# EAGLE design R2P_GW_module (EAGLE 6.3)
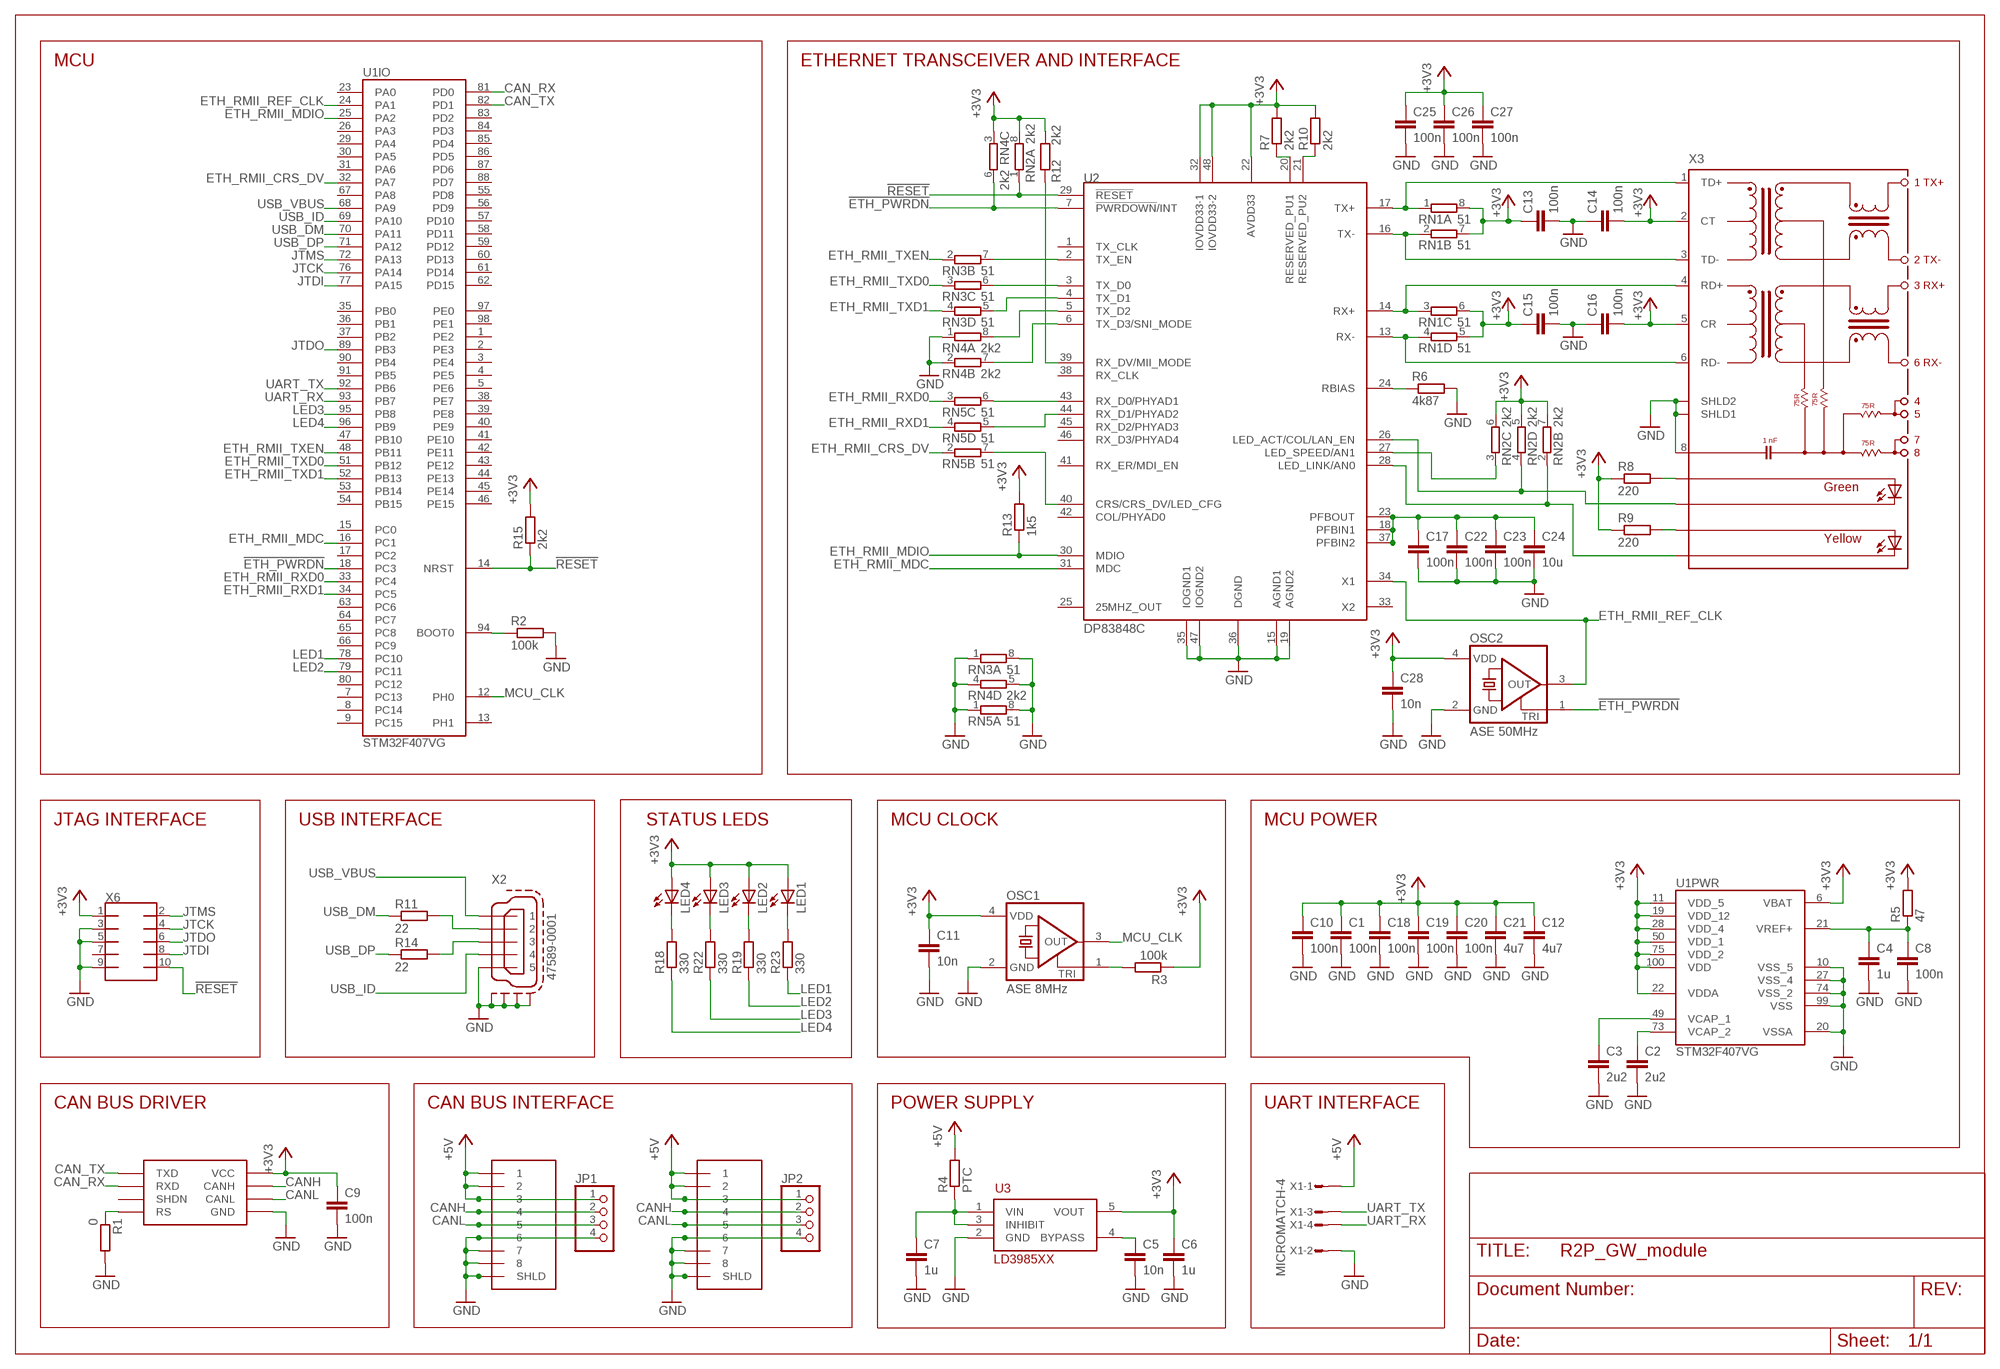
[diagram p0: schematic, sheet 1]

## Parts
C1  100n  C-EUC0603  [C0603]
C2  2u2  C-EUC0805  [C0805]
C3  2u2  C-EUC0805  [C0805]
C4  1u  C-EUC0603  [C0603]
C5  10n  C-EUC0603  [C0603]
C6  1u  C-EUC0603  [C0603]
C7  1u  C-EUC0603  [C0603]
C8  100n  C-EUC0603  [C0603]
C9  100n  C-EUC0603  [C0603]
C10  100n  C-EUC0603  [C0603]
C11  10n  C-EUC0603  [C0603]
C12  4u7  C-EUC0805  [C0805]
C13  100n  C-EUC0603  [C0603]
C14  100n  C-EUC0603  [C0603]
C15  100n  C-EUC0603  [C0603]
C16  100n  C-EUC0603  [C0603]
C17  100n  C-EUC0603  [C0603]
C18  100n  C-EUC0603  [C0603]
C19  100n  C-EUC0603  [C0603]
C20  100n  C-EUC0603  [C0603]
C21  4u7  C-EUC0805  [C0805]
C22  100n  C-EUC0603  [C0603]
C23  100n  C-EUC0603  [C0603]
C24  10u  C-EUC0805  [C0805]
C25  100n  C-EUC0603  [C0603]
C26  100n  C-EUC0603  [C0603]
C27  100n  C-EUC0603  [C0603]
C28  10n  C-EUC0603  [C0603]
JP1  PINHD-1X4  [1X04]
JP2  PINHD-1X4  [1X04]
LED1  LEDCHIPLED_0805  [CHIPLED_0805]
LED2  LEDCHIPLED_0805  [CHIPLED_0805]
LED3  LEDCHIPLED_0805  [CHIPLED_0805]
LED4  LEDCHIPLED_0805  [CHIPLED_0805]
OSC1  ASE 8MHz  ASE  [ASE]
OSC2  ASE 50MHz  ASE  [ASE]
R1  0  R-EU_R0603  [R0603]
R2  100k  R-EU_R0603  [R0603]
R3  100k  R-EU_R0603  [R0603]
R4  PTC  R-EU_R0603  [R0603]
R5  47  R-EU_R0603  [R0603]
R6  4k87  R-EU_R0603  [R0603]
R7  2k2  R-EU_R0603  [R0603]
R8  220  R-EU_R0603  [R0603]
R9  220  R-EU_R0603  [R0603]
R10  2k2  R-EU_R0603  [R0603]
R11  22  R-EU_R0603  [R0603]
R12  2k2  R-EU_R0603  [R0603]
R13  1k5  R-EU_R0603  [R0603]
R14  22  R-EU_R0603  [R0603]
R15  2k2  R-EU_R0603  [R0603]
R18  330  R-EU_R0603  [R0603]
R19  330  R-EU_R0603  [R0603]
R22  330  R-EU_R0603  [R0603]
R23  330  R-EU_R0603  [R0603]
RN1  51  4R-NCAT16  [CAT16]
RN2  2k2  4R-NCAT16  [CAT16]
RN3  51  4R-NCAT16  [CAT16]
RN4  2k2  4R-NCAT16  [CAT16]
RN5  51  4R-NCAT16  [CAT16]
U1  STM32F407VG  [LQFP100]
U2  DP83848C  [LQFP48]
U3  LD3985XX  [SOT23-5L]
U4  MAX3051  [SOT23-8L]
X1  MICROMATCH-4  [MICROMATCH-4]
X2  47589-0001  [47589-0001]
X3  SI-60062-F  [SI-60062-F]
X4  RJ45-43860  [0438600010]
X5  RJ45-43860  [0438600010]
X6  FTSH-105  [FTSH-105]

## Nets
!ETH_PWRDN: OSC2.1(TRI) RN4.6 U1.18(IO:PC3) U2.7(!PWRDOWN!/INT)
!RESET: R15.1 RN2.1 U1.14(IO:NRST) U2.29(!RESET) X6.10
+3V3: C1.1 C6.1 C9.1 C10.1 C11.1 C12.1 C13.1 C14.2 C15.1 C16.2 C18.1 C19.1 C20.1 C21.1 C25.1 C26.1 C27.1 C28.1 LED1.A LED2.A LED3.A LED4.A OSC1.4(VDD) OSC2.4(VDD) R3.1 R5.2 R7.2 R8.1 R9.1 R10.2 R12.2 R13.2 R15.2 RN1.5 RN1.6 RN1.7 RN1.8 RN2.5 RN2.6 RN2.7 RN2.8 RN4.3 U1.6(PWR:VBAT) U1.11(PWR:VDD_5) U1.19(PWR:VDD_12) U1.22(PWR:VDDA) U1.28(PWR:VDD_4) U1.50(PWR:VDD_1) U1.75(PWR:VDD_2) U1.100(PWR:VDD) U2.22(AVDD33) U2.32(IOVDD33-1) U2.48(IOVDD33-2) U3.5(VOUT) U4.P$3(VCC) X3.2(CT) X3.5(CR) X6.1
+5V: JP1.1 JP2.1 R4.2 X1.1 X4.P$1 X4.P$2 X4.P$3 X5.P$1 X5.P$2 X5.P$3
CAN_RX: U1.81(IO:PD0) U4.P$4(RXD)
CAN_TX: U1.82(IO:PD1) U4.P$1(TXD)
CANH: JP1.2 JP2.2 U4.P$7(CANH) X4.P$4 X5.P$4
CANL: JP1.3 JP2.3 U4.P$6(CANL) X4.P$5 X5.P$5
ETH_RMII_CRS_DV: RN5.2 U1.32(IO:PA7)
ETH_RMII_MDC: U1.16(IO:PC1) U2.31(MDC)
ETH_RMII_MDIO: R13.1 U1.25(IO:PA2) U2.30(MDIO)
ETH_RMII_REF_CLK: OSC2.3(OUT) U1.24(IO:PA1) U2.34(X1)
ETH_RMII_RXD0: RN5.3 U1.33(IO:PC4)
ETH_RMII_RXD1: RN5.4 U1.34(IO:PC5)
ETH_RMII_TXD0: RN3.3 U1.51(IO:PB12)
ETH_RMII_TXD1: RN3.4 U1.52(IO:PB13)
ETH_RMII_TXEN: RN3.2 U1.48(IO:PB11)
GND: C1.2 C2.2 C3.2 C4.2 C5.2 C6.2 C7.2 C8.2 C9.2 C10.2 C11.2 C12.2 C13.2 C14.1 C15.2 C16.1 C17.2 C18.2 C19.2 C20.2 C21.2 C22.2 C23.2 C24.2 C25.2 C26.2 C27.2 C28.2 JP1.4 JP2.4 OSC1.2(GND) OSC2.2(GND) R1.2 R2.2 R6.2 RN3.1 RN3.8 RN4.1 RN4.2 RN4.4 RN4.5 RN5.1 RN5.8 U1.10(PWR:VSS_5) U1.20(PWR:VSSA) U1.27(PWR:VSS_4) U1.74(PWR:VSS_2) U1.99(PWR:VSS) U2.15(AGND1) U2.19(AGND2) U2.35(IOGND1) U2.36(DGND) U2.47(IOGND2) U3.2(GND) U4.P$2(GND) X1.2 X2.5 X2.SHLD1 X2.SHLD2 X2.SHLD3 X2.SHLD4 X3.8 X3.SHLD1 X3.SHLD2 X4.P$6 X4.P$7 X4.P$8 X4.P$9(SHLD) X4.P$10 X5.P$6 X5.P$7 X5.P$8 X5.P$9(SHLD) X5.P$10 X6.3 X6.5 X6.9
JTCK: U1.76(IO:PA14) X6.4
JTDI: U1.77(IO:PA15) X6.8
JTDO: U1.89(IO:PB3) X6.6
JTMS: U1.72(IO:PA13) X6.2
LED1: R23.1 U1.78(IO:PC10)
LED2: R19.1 U1.79(IO:PC11)
LED3: R22.1 U1.95(IO:PB8)
LED4: R18.1 U1.96(IO:PB9)
MCU_CLK: OSC1.3(OUT) U1.12(IO:PH0)
N$1: C4.1 C8.1 R5.1 U1.21(PWR:VREF+)
N$2: R1.1 U4.P$8(RS)
N$3: OSC1.1(TRI) R3.2
N$4: C5.1 U3.4(BYPASS)
N$5: C7.1 R4.1 U3.1(VIN) U3.3(INHIBIT)
N$6: R6.1 U2.24(RBIAS)
N$7: R11.2 X2.2
N$8: RN1.1 U2.17(TX+) X3.1(TD+)
N$9: RN1.2 U2.16(TX-) X3.3(TD-)
N$10: RN1.3 U2.14(RX+) X3.4(RD+)
N$11: RN1.4 U2.13(RX-) X3.6(RD-)
N$12: R9.2 X3.YA
N$14: C17.1 C22.1 C23.1 C24.1 U2.18(PFBIN1) U2.23(PFBOUT) U2.37(PFBIN2)
N$15: LED4.C R18.2
N$17: R8.2 X3.GA
N$18: LED2.C R19.2
N$19: RN2.3 U2.27(LED_SPEED/AN1)
N$20: LED3.C R22.2
N$21: RN3.7 U2.2(TX_EN)
N$22: LED1.C R23.2
N$23: RN2.2 U2.28(LED_LINK/AN0) X3.YK
N$24: RN2.4 U2.26(LED_ACT/COL/LAN_EN) X3.GK
N$25: RN3.6 U2.3(TX_D0)
N$26: R2.1 U1.94(IO:BOOT0)
N$27: R7.1 U2.20(RESERVED_PU1)
N$28: R10.1 U2.21(RESERVED_PU2)
N$29: RN3.5 U2.4(TX_D1)
N$30: RN4.8 U2.5(TX_D2)
N$31: RN4.7 U2.6(TX_D3/SNI_MODE)
N$32: R14.2 X2.3
N$34: RN5.6 U2.43(RX_D0/PHYAD1)
N$38: R12.1 U2.39(RX_DV/MII_MODE)
N$40: RN5.5 U2.44(RX_D1/PHYAD2)
N$41: RN5.7 U2.40(CRS/CRS_DV/LED_CFG)
UART_RX: U1.93(IO:PB7) X1.4
UART_TX: U1.92(IO:PB6) X1.3
USB_DM: R11.1 U1.70(IO:PA11)
USB_DP: R14.1 U1.71(IO:PA12)
USB_ID: U1.69(IO:PA10) X2.4
USB_VBUS: U1.68(IO:PA9) X2.1
VCAP_1: C3.1 U1.49(PWR:VCAP_1)
VCAP_2: C2.1 U1.73(PWR:VCAP_2)
Unconnected: U1.1(IO:PE2) U1.2(IO:PE3) U1.3(IO:PE4) U1.4(IO:PE5) U1.5(IO:PE6) U1.7(IO:PC13) U1.8(IO:PC14) U1.9(IO:PC15) U1.13(IO:PH1) U1.15(IO:PC0) U1.17(IO:PC2) U1.23(IO:PA0) U1.26(IO:PA3) U1.29(IO:PA4) U1.30(IO:PA5) U1.31(IO:PA6) U1.35(IO:PB0) U1.36(IO:PB1) U1.37(IO:PB2) U1.38(IO:PE7) U1.39(IO:PE8) U1.40(IO:PE9) U1.41(IO:PE10) U1.42(IO:PE11) U1.43(IO:PE12) U1.44(IO:PE13) U1.45(IO:PE14) U1.46(IO:PE15) U1.47(IO:PB10) U1.53(IO:PB14) U1.54(IO:PB15) U1.55(IO:PD8) U1.56(IO:PD9) U1.57(IO:PD10) U1.58(IO:PD11) U1.59(IO:PD12) U1.60(IO:PD13) U1.61(IO:PD14) U1.62(IO:PD15) U1.63(IO:PC6) U1.64(IO:PC7) U1.65(IO:PC8) U1.66(IO:PC9) U1.67(IO:PA8) U1.80(IO:PC12) U1.83(IO:PD2) U1.84(IO:PD3) U1.85(IO:PD4) U1.86(IO:PD5) U1.87(IO:PD6) U1.88(IO:PD7) U1.90(IO:PB4) U1.91(IO:PB5) U1.97(IO:PE0) U1.98(IO:PE1) U2.1(TX_CLK) U2.25(25MHZ_OUT) U2.33(X2) U2.38(RX_CLK) U2.41(RX_ER/MDI_EN) U2.42(COL/PHYAD0) U2.45(RX_D2/PHYAD3) U2.46(RX_D3/PHYAD4) U4.P$5(SHDN) X6.7

## Notes on the sheet
- MCU | ETHERNET TRANSCEIVER AND INTERFACE
- JTAG INTERFACE | USB INTERFACE | STATUS LEDS | MCU CLOCK | MCU POWER
- CAN BUS DRIVER | CAN BUS INTERFACE | POWER SUPPLY | UART INTERFACE

## Library data of the parts
C1-C28 = rcl:C-EU: CAPACITOR, European symbol
JP1 JP2 = misc:PINHD-1X4: PIN HEADER
LED1-LED4 = led:LED: LED OSRAM: - CHIPLED LG R971, LG N971, LY N971, LG Q971, LY Q971, LO R971, LY R971 LH N974, LH R974 LS Q976, LO Q976, LY Q976 LO Q996 - Hyper CHIPLED LW Q18S LB Q993, LB Q99A, LB R99A - SideLED LS A670, LO A670, LY A670, LG A670, LP A670 LB A673, LV A673, LT A673, LW A673 LH A674 LY A675 LS A676, LA A676, LO A676, LY A676, LW A676 LS A679, LY A679, LG A679 - Hyper Micro SIDELED® LS Y876, LA Y876, LO Y876, LY Y876 LT Y87S - SmartLED LW L88C, LW L88S LB L89C, LB L89S, LG L890 LS L89K, LO L89K, LY L89K LS L896, LA L896, LO L896, LY L896 - TOPLED LS T670, LO T670, LY T670, LG T670, LP T670 LSG T670, LSP T670, LSY T670, LOP T670, LYG T670 LG T671, LOG T671, LSG T671 LB T673, LV T673, LT T673, LW T673 LH T674 LS T676, LA T676, LO T676, LY T676, LB T676, LH T676, LSB T676, LW T676 LB T67C, LV T67C, LT T67C, LS T67K, LO T67K, LY T67K, LW E67C LS E67B, LA E67B, LO E67B, LY E67B, LB E67C, LV E67C, LT E67C LW T67C LS T679, LY T679, LG T679 LS T770, LO T770, LY T770, LG T770, LP T770 LB T773, LV T773, LT T773, LW T773 LH T774 LS E675, LA E675, LY E675, LS T675 LS T776, LA T776, LO T776, LY T776, LB T776 LHGB T686 LT T68C, LB T68C - Hyper Mini TOPLED® LB M676 - Mini TOPLED Santana® LG M470 LS M47K, LO M47K, LY M47K Source: http://www.osram.convergy.de LUXEON: - LUMILED® LXK2-PW12-R00, LXK2-PW12-S00, LXK2-PW14-U00, LXK2-PW14-V00 LXK2-PM12-R00, LXK2-PM12-S00, LXK2-PM14-U00 LXK2-PE12-Q00, LXK2-PE12-R00, LXK2-PE12-S00, LXK2-PE14-T00, LXK2-PE14-U00 LXK2-PB12-K00, LXK2-PB12-L00, LXK2-PB12-M00, LXK2-PB14-N00, LXK2-PB14-P00, LXK2-PB14-Q00 LXK2-PR12-L00, LXK2-PR12-M00, LXK2-PR14-Q00, LXK2-PR14-R00 LXK2-PD12-Q00, LXK2-PD12-R00, LXK2-PD12-S00 LXK2-PH12-R00, LXK2-PH12-S00 LXK2-PL12-P00, LXK2-PL12-Q00, LXK2-PL12-R00 Source: www.luxeon.com KINGBRIGHT: KA-3528ASYC Source: www.kingbright.com
OSC1 OSC2 = crystal:ASE: 3.3Vdc CMOS SMD CRYSTAL CLOCK OSCILLATOR SOurce: www.abracon.com; OC_FARNELL: unknown; OC_NEWARK: unknown
R1-R15 R18 R19 R22 R23 = rcl:R-EU_: RESISTOR, European symbol
RN1-RN5 = resistor-dil:4R-N: Array Chip Resistor Source: RS Component / Phycomp; OC_FARNELL: unknown; OC_NEWARK: unknown
U1 = st:STM32F407VG
U2 = texas-instruments:DP83848C
U3 = st:LD3985XX
U4 = maxim:MAX3051
X1 = tyco:MICROMATCH-4: MicroMaTch 4
X2 = molex:47589-0001
X3 = bel:SI-60062-F
X4 X5 = molex:RJ45-43860
X6 = samtec:FTSH-105

## Board
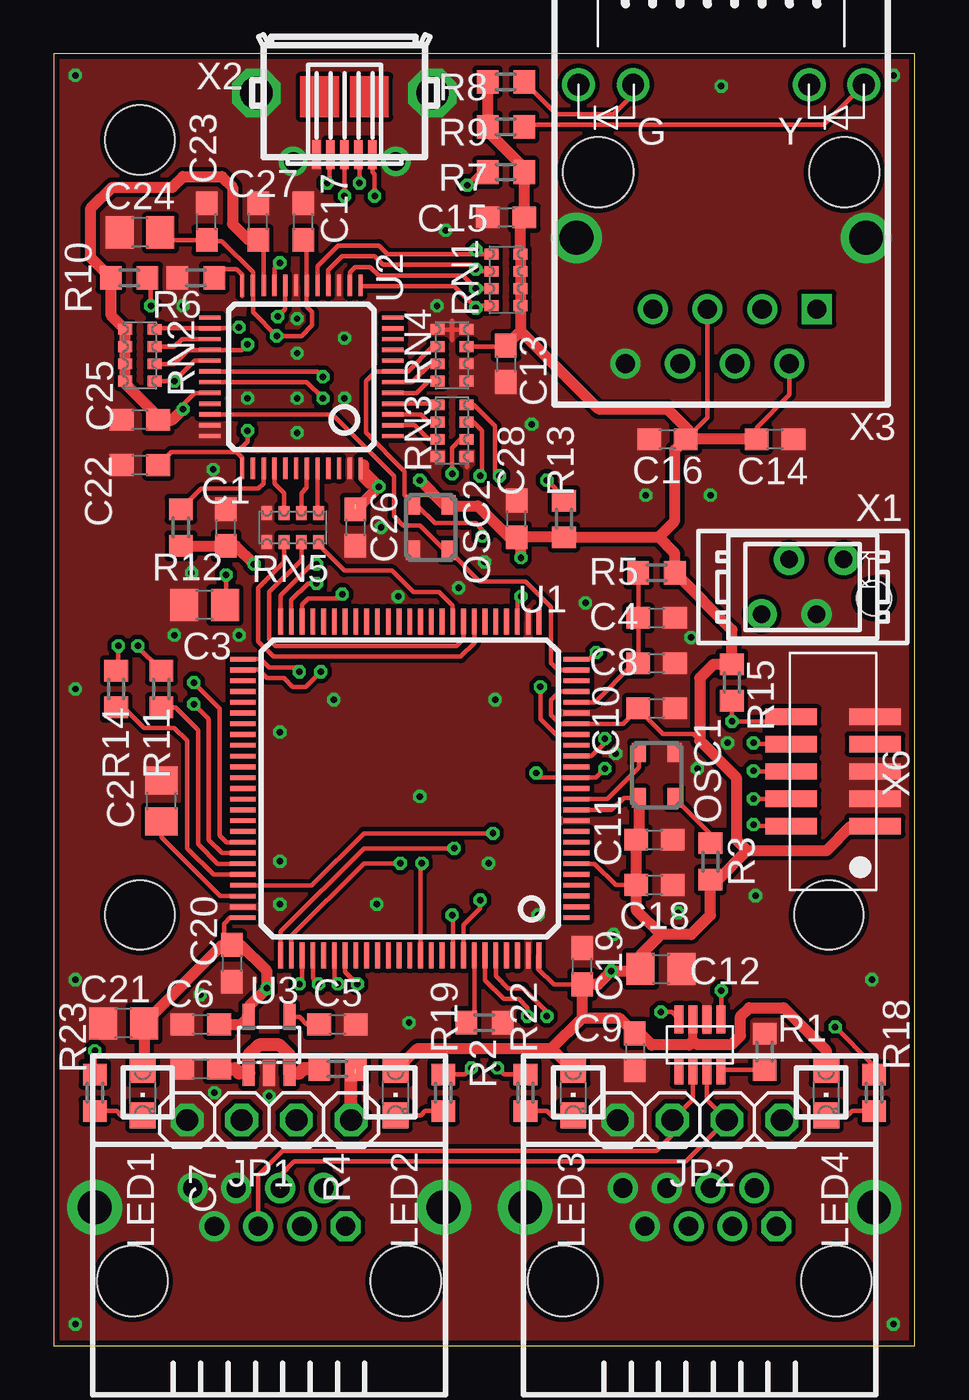
[diagram p1: board, top side]
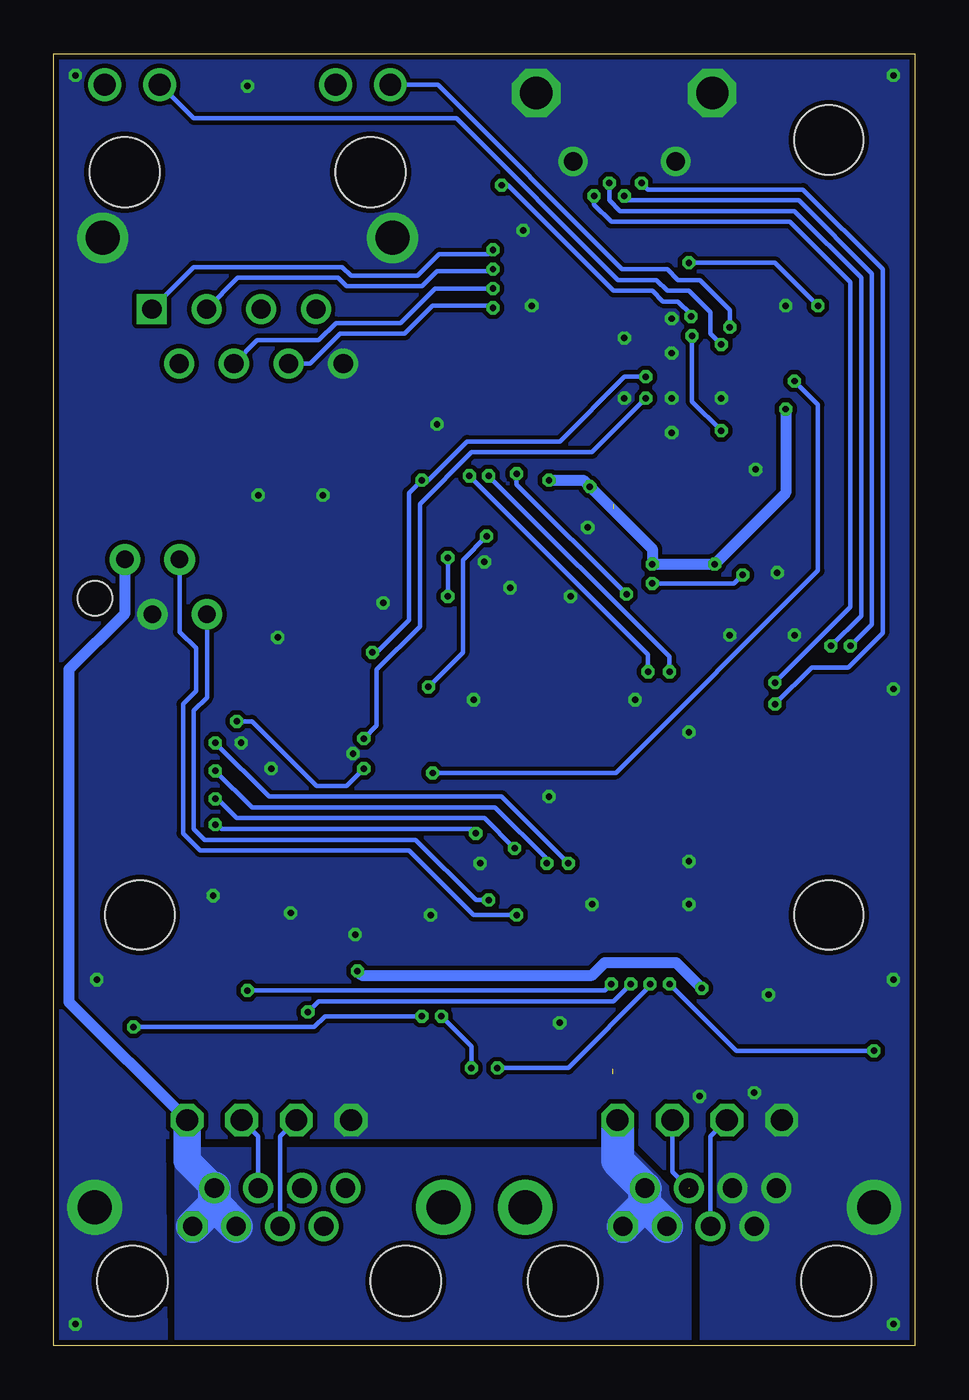
[diagram p2: board, bottom side, seen from below]

Size 40 x 60 mm. Coordinates in mm from the lower left corner, seen from the top.
Outline: 0,0 40,0 40,60 0,60 0,0
Copper layers (1*16): Top 0.035mm / dielectric 1.5mm / Bottom 0.035mm
Design rules "default": minimum track width 8mil, minimum drill 0.3mm, track to track 8mil, track to pad 8mil, pad to pad 8mil, via to via 8mil, smd to smd 0mil, copper to edge 10mil, drill to drill 10mil, minimum pad ring 10mil, minimum via ring 6mil, stop-mask expansion 2mil, vias tented up to drill 100mil, thermal gap 10mil
Holes 3.2 mm at 4,20 36,20 4,56

### Footprints (pad centres in the part's own frame; a part is rotated, then mirrored left to right if it is on the bottom)
C0603 = smd 1.1 x 1: 1 -0.85,0; 2 0.85,0
C0805 = smd 1.3 x 1.5: 1 -0.95,0; 2 0.95,0
1X04 = drill 1.016 octagon: 1 -3.81,0; 2 -1.27,0; 3 1.27,0; 4 3.81,0
CHIPLED_0805 = smd 1.2 x 1.2: A 0,-1.05; C 0,1.05
ASE = smd 0.9 x 0.65: 1 -1.05,-0.825; 2 1.05,-0.825; 3 1.05,0.825; 4 -1.05,0.825
R0603 = smd 1 x 1.1: 1 -0.85,0; 2 0.85,0
CAT16 = smd 0.5 x 0.65: 1 -1.2,-0.675; 2 -0.4,-0.675; 3 0.4,-0.675; 4 1.2,-0.675; 5 1.2,0.675; 6 0.4,0.675; 7 -0.4,0.675; 8 -1.2,0.675
LQFP100 = smd 1.2 x 0.22: 1 -7.302,6.099; 2 -7.302,5.599; 3 -7.302,5.099; 4 -7.302,4.599; 5 -7.302,4.099; 6 -7.302,3.599; 7 -7.302,3.099; 8 -7.302,2.599; 9 -7.302,2.099; 10 -7.302,1.599; 11 -7.302,1.099; 12 -7.302,0.599; 13 -7.302,0.099; 14 -7.302,-0.401; 15 -7.302,-0.901; 16 -7.302,-1.401; 17 -7.302,-1.901; 18 -7.302,-2.401; 19 -7.302,-2.901; 20 -7.302,-3.401; 21 -7.302,-3.901; 22 -7.302,-4.401; 23 -7.302,-4.901; 24 -7.302,-5.401; 25 -7.302,-5.901; 51 8.202,-5.899; 52 8.202,-5.399; 53 8.202,-4.899; 54 8.202,-4.399; 55 8.202,-3.899; 56 8.202,-3.399; 57 8.202,-2.899; 58 8.202,-2.399; 59 8.202,-1.899; 60 8.202,-1.399; 61 8.202,-0.899; 62 8.202,-0.399; 63 8.202,0.101; 64 8.202,0.601; 65 8.202,1.101; 66 8.202,1.601; 67 8.202,2.101; 68 8.202,2.601; 69 8.202,3.101; 70 8.202,3.601; 71 8.202,4.101; 72 8.202,4.601; 73 8.202,5.101; 74 8.202,5.601; 75 8.202,6.101 | smd 0.22 x 1.2: 26 -5.549,-7.652; 27 -5.049,-7.652; 28 -4.549,-7.652; 29 -4.049,-7.652; 30 -3.549,-7.652; 31 -3.049,-7.652; 32 -2.549,-7.652; 33 -2.049,-7.652; 34 -1.549,-7.652; 35 -1.049,-7.652; 36 -0.549,-7.652; 37 -0.049,-7.652; 38 0.451,-7.652; 39 0.951,-7.652; 40 1.451,-7.652; 41 1.951,-7.652; 42 2.451,-7.652; 43 2.951,-7.652; 44 3.451,-7.652; 45 3.951,-7.652; 46 4.451,-7.652; 47 4.951,-7.652; 48 5.451,-7.652; 49 5.951,-7.652; 50 6.451,-7.652; 76 6.449,7.852; 77 5.949,7.852; 78 5.449,7.852; 79 4.949,7.852; 80 4.449,7.852; 81 3.949,7.852; 82 3.449,7.852; 83 2.949,7.852; 84 2.449,7.852; 85 1.949,7.852; 86 1.449,7.852; 87 0.949,7.852; 88 0.449,7.852; 89 -0.051,7.852; 90 -0.551,7.852; 91 -1.051,7.852; 92 -1.551,7.852; 93 -2.051,7.852; 94 -2.551,7.852; 95 -3.051,7.852; 96 -3.551,7.852; 97 -4.051,7.852; 98 -4.551,7.852; 99 -5.051,7.852; 100 -5.551,7.852
LQFP48 = smd 0.2 x 1: 1 -2.75,-4.25; 2 -2.25,-4.25; 3 -1.75,-4.25; 4 -1.25,-4.25; 5 -0.75,-4.25; 6 -0.25,-4.25; 7 0.25,-4.25; 8 0.75,-4.25; 9 1.25,-4.25; 10 1.75,-4.25; 11 2.25,-4.25; 12 2.75,-4.25; 25 2.75,4.25; 26 2.25,4.25; 27 1.75,4.25; 28 1.25,4.25; 29 0.75,4.25; 30 0.25,4.25; 31 -0.25,4.25; 32 -0.75,4.25; 33 -1.25,4.25; 34 -1.75,4.25; 35 -2.25,4.25; 36 -2.75,4.25 | smd 1 x 0.2: 13 4.25,-2.75; 14 4.25,-2.25; 15 4.25,-1.75; 16 4.25,-1.25; 17 4.25,-0.75; 18 4.25,-0.25; 19 4.25,0.25; 20 4.25,0.75; 21 4.25,1.25; 22 4.25,1.75; 23 4.25,2.25; 24 4.25,2.75; 37 -4.25,2.75; 38 -4.25,2.25; 39 -4.25,1.75; 40 -4.25,1.25; 41 -4.25,0.75; 42 -4.25,0.25; 43 -4.25,-0.25; 44 -4.25,-0.75; 45 -4.25,-1.25; 46 -4.25,-1.75; 47 -4.25,-2.25; 48 -4.25,-2.75
SOT23-5L = smd 0.55 x 1.2: 1 -0.95,-1.3; 2 0,-1.3; 3 0.95,-1.3; 4 0.95,1.3; 5 -0.95,1.3
SOT23-8L = smd 1.3 x 0.42: P$1 -1.175,1.3; P$2 -1.175,0.65; P$3 -1.175,0; P$4 -1.175,-0.65; P$5 1.175,-0.65; P$6 1.175,0; P$7 1.175,0.65; P$8 1.175,1.3
MICROMATCH-4 = drill 0.813 pad 1.422: 1 1.905,1.27; 2 0.635,-1.27; 3 -0.635,1.27; 4 -1.905,-1.27 | hole 1.6: 3.305,-0.53
47589-0001 = smd 1.35 x 0.4: 1 2.68,1.3; 2 2.68,0.65; 3 2.68,0; 4 2.68,-0.65; 5 2.68,-1.3 | drill 1.5 pad 1.9 octagon: SHLD1 -0.18,4.09; SHLD2 -0.18,-4.09 | drill 0.85 pad 1.1: SHLD3 3,2.38; SHLD4 3,-2.38
SI-60062-F = drill 0.889 square: 1 -4.445,6.35 | drill 0.889: 2 -3.175,8.89; 3 -1.905,6.35; 4 -0.635,8.89; 5 0.635,6.35; 6 1.905,8.89; 7 3.175,6.35; 8 4.445,8.89 | drill 1.016: GA 4.089,-4.064; GK 6.629,-4.064; YA -6.629,-4.064; YK -4.089,-4.064 | drill 1.575: SHLD1 -6.731,3.048; SHLD2 6.731,3.048 | hole 3.251: 5.715,0; -5.715,0
0438600010 = drill 0.889 octagon: P$1 3.556,2.54 | drill 0.889: P$2 2.54,4.318; P$3 1.524,2.54; P$4 0.508,4.318; P$5 -0.508,2.54; P$6 -1.524,4.318; P$7 -2.54,2.54; P$8 -3.556,4.318 | drill 1.575 pad 2.54: P$9 8.103,3.429; P$10 -8.103,3.429 | hole 3.251: -6.35,0; 6.35,0
FTSH-105 = smd 0.76 x 2.4: 1 -2.54,-1.95; 2 -2.54,1.95; 3 -1.27,-1.95; 4 -1.27,1.95; 5 0,-1.95; 6 0,1.95; 7 1.27,-1.95; 8 1.27,1.95; 9 2.54,-1.95; 10 2.54,1.95

### Placement (x,y rotation side)
C1  8,38 90 top
C2  5,25.3 90 top
C3  7,34.4 180 top
C4  28,33.8 0 top
C5  13.18,14.92 0 top
C6  6.83,14.92 180 top
C7  6.83,12.86 180 top
C8  28,31.7 0 top
C9  26.99,13.65 270 top
C10  28,29.6 0 top
C11  27.9,23.5 0 top
C12  28.2,17.5 0 top
C13  21,45.6 270 top
C14  33.5,42.1 180 top
C15  21,52.4 180 top
C16  28.5,42.1 0 top
C17  11.6,52.2 90 top
C18  27.9,21.4 0 top
C19  24.55,17.63 90 top
C20  8.26,17.76 270 top
C21  3.24,14.97 180 top
C22  4,40.9 180 top
C23  7.1,52.2 90 top
C24  4,51.7 180 top
C25  4,43 180 top
C26  14,38 270 top
C27  9.5,52.2 90 top
C28  21.5,38.4 90 top
JP1  10,10.48 180 top
JP2  30,10.48 180 top
LED1  4.13,11.75 180 top
LED2  15.88,11.75 180 top
LED3  24.13,11.75 180 top
LED4  35.88,11.75 180 top
OSC1  28,26.5 90 top
OSC2  17.5,38 270 top
R1  33.02,13.65 90 top
R2  20,15 0 top
R3  30.5,22.49 90 top
R4  13.18,12.86 0 top
R5  28,35.9 0 top
R6  6.6,49.6 180 top
R7  21,54.5 0 top
R8  21,58.7 0 top
R9  21,56.6 0 top
R10  3.5,49.6 180 top
R11  5,30.5 90 top
R12  5.9,38 270 top
R13  23.7,38.4 270 top
R14  2.9,30.5 90 top
R15  31.5,30.8 90 top
R18  38.1,11.75 270 top
R19  18.1,11.75 270 top
R22  21.91,11.75 270 top
R23  1.91,11.75 270 top
RN1  21,49.5 270 top
RN2  4,46 90 top
RN3  18.5,42.5 90 top
RN4  18.5,46 90 top
RN5  11.1,38 0 top
U1  16.98,25.98 180 top
U2  11.5,45 90 top
U3  10,13.97 0 top
U4  29.69,13.97 270 top
X1  34.79,35.24 0 top
X2  13.5,58 270 top
X3  31,54.5 180 top
X4  30,3 0 top
X5  10,3 0 top
X6  36.2,26.67 90 top

### Tracks (layer width: path | path; a pad name or v marks a point on that pad's centre or on a via)
!ETH_PWRDN  (via drill 0.3)
  Top 0.203: RN4.6 17.6,46.4 16.45,45.25 U2.7 14.95,45.25 14.5,44.8 14.5,42.4 16.3,40.6 16.3,39.5 16.68,39.12 OSC2.1 16.73,39 16.9,39 17.7,38.2 19.6,38.2 19.9,37.9 v19.9,37.6 | U1.18 23.32,28.38 22.6,29.1 v22.6,30.6
  Bottom 0.203: v19.9,37.6 21,36.5 21,32.2 v22.6,30.6
!RESET  (via drill 0.3)
  Top 0.203: U2.29 6.55,45.75 v5.6,44.8 RN2.1 | R15.1 v31.5,29 34.03,29 X6.10 | v22.4,26.6 22.62,26.38 U1.14 25.18,26.38 v25.6,26.8
  Bottom 0.203: v31.5,29 30.8,29 27.8,26 26.4,26 v25.6,26.8 | v22.4,26.6 13.9,26.6 4.5,36 4.5,43.7 v5.6,44.8
+3V3  (via drill 0.3)  (1 unrouted)
  Top 0.203: C9.1 26.81,14.68 | U1.100 22.5,18.1 22.5,17.5 23.22,16.78 | 15.9,12.8 LED2.A | U1.50 10.53,34.83 12,36.3 v12.2,36.3 | v6,43.5 6,43.7 6.55,44.25 U2.32 | v15.1,39.9 14.6,39.9 14.25,40.25 U2.48 | v21.7,34.8 21.53,34.63 U1.28 | 23.22,16.78 C19.1 | 23.22,16.78 23.23,16.77 | C27.1 9.75,51.1 U2.22 | U1.11 25.91,24.88 26.48,25.45 OSC1.4 | C18.1 26.1,21.4 25.12,22.38 U1.6 | 30,28.1 29.7,28.4 28.3,28.4 27.15,29.55 C10.1 26.43,28.88 U1.19 23.52,28.88 23.1,29.3 23.1,30 23.48,30.38 U1.22 | U1.75 8.18,19.88 7.9,19.6 7.9,18.98 C20.1 | X3.5 30.36,43.12 C16.2 | C14.2 32.65,42.65 34.17,44.17 X3.2 | RN4.3 20.95,46.4 C13.1
  Top 0.406: 29.69,14.15 U4.P$3
  Top 0.508: C9.1 27.24,14.5 27.77,13.97 29.51,13.97 29.69,14.15 29.83,14 31.5,14 31.9,14.4 31.9,15.3 32.3,15.7 33.9,15.7 35.88,13.72 LED4.A | R8.1 R9.1 20.15,56.4 21.85,54.7 R7.2 C15.1 21.68,52.23 RN1.8 RN1.7 RN1.6 RN1.5 21.68,47.12 | v6,43.5 5.5,43 C25.1 4.85,43.15 3.33,44.67 RN2.8 RN2.7 RN2.6 RN2.5 2.65,47.88 R10.2 1.7,50.55 1.7,52.8 2.7,53.8 5.5,53.8 6,54.3 7.8,54.3 8.3,53.8 8.3,52.1 9.05,51.35 C27.1 | C6.1 8.7,14.92 U3.5 | 9,15.32 U3.5 | X6.1 37.03,24.13 35.9,23 32.2,23 | v9.3,36.3 8.45,37.15 C1.1 R12.2 | 14,39.1 14.3,39.1 v15.1,39.9 14.4,40.6 14.4,40.9 | C9.1 27,14.52 | 15.9,12.8 16.9,13.8 23.13,13.8 | 23.13,13.8 LED3.A | 23.13,13.8 24.55,15.22 | 24.55,15.22 C19.1 25.28,16.78 v25.9,17.4 27.15,17.4 C12.1 27.25,18.15 28.2,19.1 | 24.55,15.22 26.27,15.22 C9.1 | OSC1.4 27.18,23.62 C11.1 C18.1 27.05,20.25 28.2,19.1 | 28.2,19.1 29.6,19.1 30.5,20 R3.1 30.84,21.64 32.2,23 | 32.2,23 31.7,23.5 31.7,26.4 30,28.1 30,31 30.65,31.65 R15.2 31.5,33.25 R5.2 28.85,36.8 28.1,37.55 | U3.5 9.05,15.75 v9.9,16.6 9.9,17.4 8.69,18.61 C20.1 7.83,18.61 C21.1 | v17,40.2 18.15,39.05 OSC2.4 18.38,39 19.7,39 21.15,37.55 C28.1 | C28.1 R13.2 28.1,37.55 | v21.7,36.6 21.7,37.35 C28.1 | C21.1 4.19,12.86 LED1.A | C21.1 4.19,15.26 | C16.2 28.85,41.6 28.85,38.3 28.1,37.55 | C14.2 C16.2 | C16.2 29.5,42.25 29.5,42.5 28.5,43.5 25.3,43.5 21.68,47.12 | 21.68,47.12 C13.1
  Bottom 0.203: v21.7,34.8 v21.7,36.6
  Bottom 0.508: v6,43.5 6,39.6 v9.3,36.3 v12.2,36.3 12.2,37 v15.1,39.9 15.4,40.2 v17,40.2 | v25.9,17.4 25.7,17.2 15,17.2 14.4,17.8 11.1,17.8 v9.9,16.6
+5V  (1 unrouted)
  Top 0.61: JP1.1 13.81,12.4 14.03,12.62
  Bottom 0.508: X1.1 36.7,34.01 39.3,31.41 39.3,15.96 JP2.1
  Bottom 1.27: JP2.1 33.81,8.59 X4.P$2
  Bottom 1.524: JP1.1 13.81,8.59 X5.P$2 12.54,6.56 | 12.54,6.56 X5.P$1 | X5.P$3 12.54,6.56 | X4.P$1 32.54,6.56 | X4.P$3 32.54,6.56 | 32.54,6.56 X4.P$2
  pour Bottom (no thermals): 10.48,0 10.48,6.33 13.23,9.11 34.29,9.11 34.29,0
CAN_RX  (via drill 0.3)
  Top 0.203: v28.2,15.5 28.7,15.5 29.04,15.16 U4.P$4 | U1.81 13.03,16.97 v13.2,16.8
  Bottom 0.203: v13.2,16.8 14,16 27.7,16 v28.2,15.5
CAN_TX  (via drill 0.3)
  Top 0.203: U1.82 13.53,17.37 v14.1,16.8 | v31,16.5 U4.P$1
  Bottom 0.203: v14.1,16.8 14.4,16.5 v31,16.5
CANH  (1 unrouted)
  Top 0.203: U4.P$7 30.34,11.41 JP2.2 29.37,8.57 11.17,8.57 10.5,7.9 10.5,7.34 10.51,7.33
  Bottom 0.203: JP1.2 11.27,8.08 X5.P$4 | X4.P$4 30.51,9.71 JP2.2
CANL
  Top 0.203: U4.P$6 29.69,11.43 JP2.3 28.73,9.8 27.98,9.05 10.64,9.05 9.49,7.9 X5.P$5
  Bottom 0.203: X4.P$5 29.49,9.72 JP2.3 | X5.P$5 9.49,9.72 JP1.3
ETH_RMII_CRS_DV
  Top 0.203: U1.32 19.53,32.63 18.9,32 10.2,32 9.5,32.7 9.5,35.2 10.7,36.4 RN5.2
ETH_RMII_MDC  (via drill 0.3)
  Top 0.203: U2.31 11.75,44.75 v12.5,44 | U1.16 24.98,27.38 25.6,28 v25.6,28.2
  Bottom 0.203: v25.6,28.2 25,28.8 25,31.4 23,33.4 23,39.1 20.6,41.5 15,41.5 v12.5,44
ETH_RMII_MDIO  (via drill 0.3)
  Top 0.203: U1.25 24.88,31.88 v25.2,32.2 | U2.30 12.25,45.25 v12.5,45 | v22.9,40.2 23.7,39.4 R13.1
  Bottom 0.203: v25.2,32.2 25,32.2 23.5,33.7 23.5,39.6 v22.9,40.2 22.6,40.2 20.8,42 16.5,42 13.5,45 v12.5,45
ETH_RMII_REF_CLK
  Top 0.203: U2.34 12.95,43.25 15.8,40.4 15.8,38.52 16.23,38.1 17,38.1 18.15,36.95 OSC2.3 19.77,35.5 21.9,35.5 23.1,34.3 23.1,31.7 23.42,31.38 U1.24
ETH_RMII_RXD0
  Top 0.203: U1.33 19.03,32.83 18.7,32.5 10.3,32.5 10,32.8 10,35 11.5,36.5 RN5.3
ETH_RMII_RXD1
  Top 0.203: U1.34 18.53,34.37 17.9,35 16.7,35 15.7,36 13.5,36 12.3,37.2 RN5.4
ETH_RMII_TXD0  (via drill 0.3)
  Top 0.203: U1.51 8.8,31.9 9.6,31.9 10,31.5 11.2,31.5 v11.4,31.3 | RN3.3 19.5,42.9 19.9,42.5 19.9,40.5 v19.8,40.4
  Bottom 0.203: v19.8,40.4 11.4,32 v11.4,31.3
ETH_RMII_TXD1  (via drill 0.3)
  Top 0.203: U1.52 8.8,31.4 9.5,31.4 9.9,31 10.7,31 11.1,30.6 11.7,30.6 v12.4,31.3 | v20.7,40.4 20.5,40.6 20.5,42.7 19.5,43.7 RN3.4
  Bottom 0.203: v20.7,40.4 12.4,32.1 v12.4,31.3
ETH_RMII_TXEN  (via drill 0.3)
  Top 0.203: RN3.2 18.9,42.1 18.5,41.7 v18.5,40.5 | v13.4,34.9 13.2,34.7 11.8,34.7 11.53,34.43 U1.48
  Bottom 0.203: v18.5,40.5 18.5,40 v13.4,34.9
GND  (via drill 0.3)
  Top 0.203: 18,47.2 19,47.2 | 18.5,46.7 18.5,47.6 | 19.2,41.3 19.2,40.8
  other vias: 10,11.59 7.46,11.75 11.3,42.4 13.5,44 11.3,47.7 15,20.5 10.5,20.5 20.2,22.4 9,44 31.3,28 26,19.1 32.6,20.9 20,36.4 15.2,38 18.8,35.2 26.1,27.5 10.5,28.5 13,30 1,1 39,1 39,59 1,59 1,30.5 8.6,33 5.6,33 7.4,40.7 6.8,16.3 16.5,15 29.9,26.8 24.7,34.5 13.5,46.8 6.4,35.9 29.6,32.9 29,20.1 1,17 38,17 17.8,48.3 22.2,42.8 16,34.8 18.2,51.8 17,25.5 10.5,22.5 20.5,30 6,48.3 31,58.5 27.5,39.5 30.5,39.5 22.5,20 11.3,44 11.3,46.1
  pour Top (no thermals): 0,60 40,60 40,0 0,0
  pour Bottom (no thermals): 9.9,0 0,0 0,60 40,60 40,0 34.8,0.1 34.9,9.7 13.1,9.7 9.9,6.5
JTCK  (via drill 0.3)
  Top 0.203: X6.4 v32.5,25.4 | U1.76 10.53,19.23 14.4,23.1 v18.6,23.1
  Bottom 0.203: v32.5,25.4 32.4,25.4 31.5,24.5 20,24.5 v18.6,23.1
JTDI  (via drill 0.3)
  Top 0.203: X6.8 32.56,27.94 v32.5,28 | U1.77 11.03,19.03 14.4,22.4 v16.1,22.4
  Bottom 0.203: v32.5,28 30,25.5 19.2,25.5 v16.1,22.4
JTDO  (via drill 0.3)
  Top 0.203: X6.6 32.53,26.67 v32.5,26.7 | U1.89 17.03,22.33 v17.1,22.4
  Bottom 0.203: v32.5,26.7 30.8,25 19.5,25 17.1,22.6 v17.1,22.4
JTMS  (via drill 0.3)
  Top 0.203: X6.2 32.57,24.13 v32.5,24.2 | v20.4,23.8 14.4,23.8 11.98,21.38 U1.72
  Bottom 0.203: v32.5,24.2 32.4,24.2 32.2,24 20.6,24 v20.4,23.8
LED1  (via drill 0.3)
  Top 0.203: R23.1 v1.91,13.7 v1.9,13.7 | U1.78 11.53,16.93 v11.4,16.8
  Bottom 0.203: v1.9,13.7 8.3,13.7 v11.4,16.8
LED2  (via drill 0.3)
  Top 0.203: U1.79 12.03,17.07 v12.3,16.8 | v19.4,12.9 19.1,12.6 R19.1
  Bottom 0.203: v12.3,16.8 12.3,16.7 16.1,12.9 v19.4,12.9
LED3  (via drill 0.3)
  Top 0.203: 22,12.69 R22.1 20.9,12.6 v20.6,12.9 | U1.95 20.03,16.97 20.9,16.1 21.6,16.1 22,15.7 v22,15.3
  Bottom 0.203: v22,15.3 20.6,13.9 v20.6,12.9
LED4  (via drill 0.3)
  Top 0.203: R18.1 38,12.7 38,13.1 v36.3,14.8 | v22.9,15.3 22.9,15.5 21.8,16.6 21.1,16.6 20.53,17.17 U1.96
  Bottom 0.203: v36.3,14.8 27.9,14.8 27.4,15.3 v22.9,15.3
MCU_CLK
  Top 0.203: U1.12 25.71,25.38 27.18,26.85 OSC1.3
N$1
  Top 0.203: U1.21 25.13,29.88 26.95,31.7 C8.1 | C8.1 26.95,31.9 | C8.1 C4.1 R5.1
N$2
  Top 0.203: R1.1 30.99,12.8 U4.P$8
N$3
  Top 0.203: OSC1.1 30.5,23.77 R3.2
N$4
  Top 0.203: U3.4 11.4,15.27 11.43,15.24 11.75,14.92 C5.1
N$5
  Top 0.203: 8.6,12.67 8.57,12.7 | 11.4,12.67 11.43,12.7
  Top 0.61: 8.6,12.67 U3.1 9.05,13.5 9.53,13.97 10.48,13.97 10.95,13.5 U3.3 11.4,12.67 | C7.1 8.41,12.86 8.57,12.7 | R4.1 11.59,12.86 11.43,12.7
N$6
  Top 0.203: 8.75,48.75 U2.24 8.75,49.75 8.5,50 7.85,50 R6.1
N$7  (via drill 0.3)
  Top 0.203: X2.2 14.2,55.27 v14.2,54 | 4.65,31.35 R11.2 3.85,32.5 v3.9,32.5
  Bottom 0.203: v14.2,54 14.2,53.2 13.7,52.7 5.6,52.7 2.5,49.6 2.5,33.9 v3.9,32.5
N$8  (via drill 0.3)
  Top 0.203: U2.17 12.25,50.15 13.2,51.1 15.1,51.1 15.5,50.7 19.4,50.7 v19.6,50.9 19.8,50.7 RN1.1
  Bottom 0.203: X3.1 33.49,50.1 26.6,50.1 26.2,49.7 23.1,49.7 22.1,50.7 19.8,50.7 v19.6,50.9
N$9  (via drill 0.3)
  Top 0.203: U2.16 12.75,49.95 13.4,50.6 14.9,50.6 15.3,50.2 19.4,50.2 v19.6,50 19.7,49.9 RN1.2
  Bottom 0.203: X3.3 31.45,49.6 26.8,49.6 26.4,49.2 22.9,49.2 22.2,49.9 19.7,49.9 v19.6,50
N$10  (via drill 0.3)
  Top 0.203: U2.14 13.75,49.85 14,50.1 14.7,50.1 15.1,49.7 19,49.7 v19.6,49.1 RN1.3
  Bottom 0.203: X3.4 30.55,46.7 27.7,46.7 26.9,47.5 23.9,47.5 22.3,49.1 v19.6,49.1
N$11  (via drill 0.3)
  Top 0.203: U2.13 14.3,49.2 18.6,49.2 v19.6,48.2 19.7,48.3 RN1.4
  Bottom 0.203: v19.6,48.2 19.7,48.3 22.4,48.3 23.7,47 26.7,47 28.09,45.61 X3.6
N$12
  Top 0.203: R9.2 21.95,56.7 35.77,56.7 X3.YA
N$14  (via drill 0.3)
  Top 0.203: C17.1 11.75,51.2 U2.18 11.75,48.25 12,48 12,47.4 11.5,46.9 v10.35,46.9 9.25,48 U2.23 9.25,49.85 7.8,51.3 7.15,51.3 C23.1 5.3,51.35 C24.1 | C22.1 5.45,41.5 8.5,41.5 | 8.5,41.5 8.75,41.25 U2.37 | v9,42.5 9,42 8.5,41.5
  Bottom 0.203: v10.35,46.9 10.35,43.85 v9,42.5
N$15
  Top 0.203: LED4.C 36.89,10.7 37.09,10.9 R18.2
N$17
  Top 0.203: X3.GA 26.91,58.11 26,57.2 23.35,57.2 R8.2
N$18
  Top 0.203: LED2.C 17.05,10.7 17.25,10.9 R19.2
N$19
  Top 0.203: U2.27 5.95,46.75 5.6,46.4 RN2.3
N$20
  Top 0.203: R22.2 22.92,10.9 23.12,10.7 LED3.C
N$21
  Top 0.203: U2.2 16.75,42.75 17.4,42.1 RN3.7
N$22
  Top 0.203: LED1.C 3.11,10.7 2.91,10.9 R23.2
N$23  (via drill 0.3)
  Top 0.203: RN2.2 5.6,45.6 6.25,46.25 U2.28 8.75,46.25 v9,46.5
  Bottom 0.203: X3.YK 35.06,58.56 33.5,57 21.3,57 13.8,49.5 12,49.5 11.5,49 10.5,49 9.5,48 9.5,47 v9,46.5
N$24  (via drill 0.3)
  Top 0.203: RN2.4 4.72,47.25 U2.26 8.55,47.25 v8.6,47.3
  Bottom 0.203: X3.GK 22.16,58.56 13.6,50 11.5,50 11,49.5 10,49.5 8.6,48.1 v8.6,47.3
N$25
  Top 0.203: U2.3 17.05,43.25 17.4,42.9 RN3.6
N$26
  Top 0.203: U1.94 19.53,15.38 R2.1
N$27  (via drill 0.3)
  Top 0.203: v10.4,47.8 10.75,48.15 U2.20 | R7.1 19.8,54.5 v19.2,53.9
  Bottom 0.203: v10.4,47.8 10.4,47.9 11,48.5 11.7,48.5 12.2,49 14,49 18.9,53.9 v19.2,53.9
N$28  (via drill 0.3)
  Top 0.203: U2.21 10.25,50.05 v10.5,50.3 | v4.5,48.3 4.5,49.45 R10.1
  Bottom 0.203: v10.5,50.3 6.5,50.3 v4.5,48.3
N$29
  Top 0.203: U2.4 17.77,43.75 RN3.5
N$30
  Top 0.203: U2.5 16.85,44.25 17.4,44.8 RN4.8
N$31
  Top 0.203: U2.6 16.65,44.75 17.5,45.6 RN4.7
N$32  (via drill 0.3)
  Top 0.203: X2.3 v13.5,53.4 | R14.2 3,31.45 v3,32.5
  Bottom 0.203: v13.5,53.4 13.3,53.2 5.4,53.2 2,49.8 2,33.5 v3,32.5
N$34
  Top 0.203: RN5.6 11.5,39.6 11.75,39.85 U2.43
N$38
  Top 0.203: R12.1 6.85,39.8 9.5,39.8 9.75,40.05 U2.39
N$40
  Top 0.203: U2.44 12.25,38.73 RN5.5
N$41
  Top 0.203: U2.40 10.25,40.05 10.7,39.6 RN5.7
UART_RX  (via drill 0.3)
  Top 0.203: U1.93 19.03,19.53 19.8,20.3 v19.8,20.7
  Bottom 0.203: X1.4 32.88,30.11 33.5,29.5 33.5,24 33,23.5 23.2,23.5 20.4,20.7 v19.8,20.7
UART_TX  (via drill 0.3)
  Top 0.203: U1.92 18.53,19.97 v18.5,20
  Bottom 0.203: X1.3 34.16,33.16 33.4,32.4 33.4,30.4 34,29.8 34,23.8 33.2,23 23.5,23 20.5,20 v18.5,20
USB_DM
  Top 0.203: U1.70 7.62,22.38 6.7,23.3 6.7,28.6 5.65,29.65 R11.1
USB_DP
  Top 0.203: U1.71 7.42,21.88 6.2,23.1 6.2,28.1 5.6,28.7 4.2,28.7 3.25,29.65 R14.1
USB_ID  (via drill 0.3)
  Top 0.203: X2.4 12.8,55.27 12.8,54.1 v12.7,54 | U1.69 7.82,22.88 7.2,23.5 7.2,29.1 v6.5,29.8
  Bottom 0.203: v12.7,54 12.4,53.7 5.2,53.7 1.5,50 1.5,33.1 3.1,31.5 4.8,31.5 v6.5,29.8
USB_VBUS  (via drill 0.3)
  Top 0.203: X2.1 14.8,54.5 14.9,54.4 v14.9,53.4 | U1.68 8.02,23.38 7.7,23.7 7.7,29.6 v6.5,30.8
  Bottom 0.203: v14.9,53.4 14.9,53 14.1,52.2 5.8,52.2 3,49.4 3,34.3 v6.5,30.8
VCAP_1  (via drill 0.3)
  Top 0.203: C3.1 8,34.45 v8,35.8 | v12.2,35.4 11.8,35.4 11.03,34.63 U1.49
  Bottom 0.203: v8,35.8 8.4,35.4 v12.2,35.4
VCAP_2
  Top 0.203: U1.73 7.72,20.88 5,23.6 C2.1